# Altium schematic sheet Reflective_Sensors.SchDoc
size A
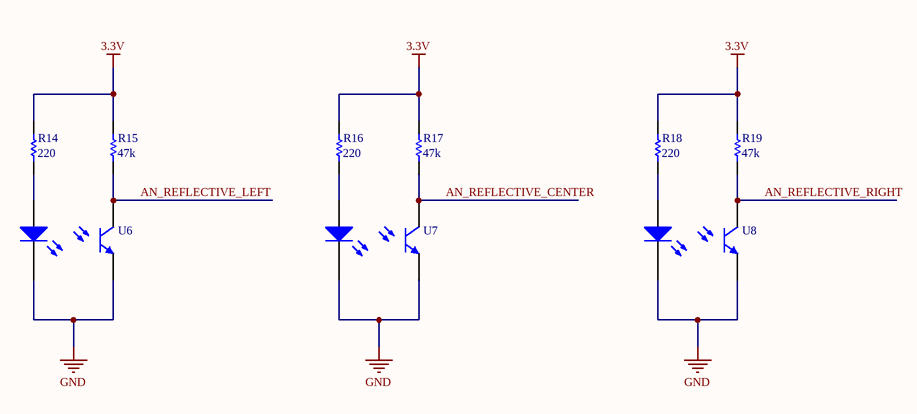
[diagram p0: Reflective_Sensors.SchDoc]

## Parts
R14  value 220  [0805]  (hidden comment: Resistor)
R15  value 47k  [0805]  (hidden comment: Resistor)
R16  value 220  [0805]  (hidden comment: Resistor)
R17  value 47k  [0805]  (hidden comment: Resistor)
R18  value 220  [0805]  (hidden comment: Resistor)
R19  value 47k  [0805]  (hidden comment: Resistor)
U6  QRE1113GR  [QRE1113GR]  (value not drawn)
U7  QRE1113GR  [QRE1113GR]  (value not drawn)
U8  QRE1113GR  [QRE1113GR]  (value not drawn)

## Nets
3.3V: R14.2 R15.2 R16.2 R17.2 R18.2 R19.2
GND: U6.2(CATHODE) U6.4(EMITTER) U7.2(CATHODE) U7.4(EMITTER) U8.2(CATHODE) U8.4(EMITTER)
AN_REFLECTIVE_CENTER: R17.1 U7.3(COLLECTOR)
AN_REFLECTIVE_LEFT: R15.1 U6.3(COLLECTOR)
AN_REFLECTIVE_RIGHT: R19.1 U8.3(COLLECTOR)
NetR14_1: R14.1 U6.1(ANODE)
NetR16_1: R16.1 U7.1(ANODE)
NetR18_1: R18.1 U8.1(ANODE)

## Library data of the parts
R14-R19 = Resistor: Published: 8-Jun-2000; LatestRevisionDate: 17-Jul-2002; LatestRevisionNote: Re-released for DXP Platform.; PackageReference: AXIAL-0.3; Publisher: Altium Limited